# EAGLE design MK (EAGLE 9.4.2)
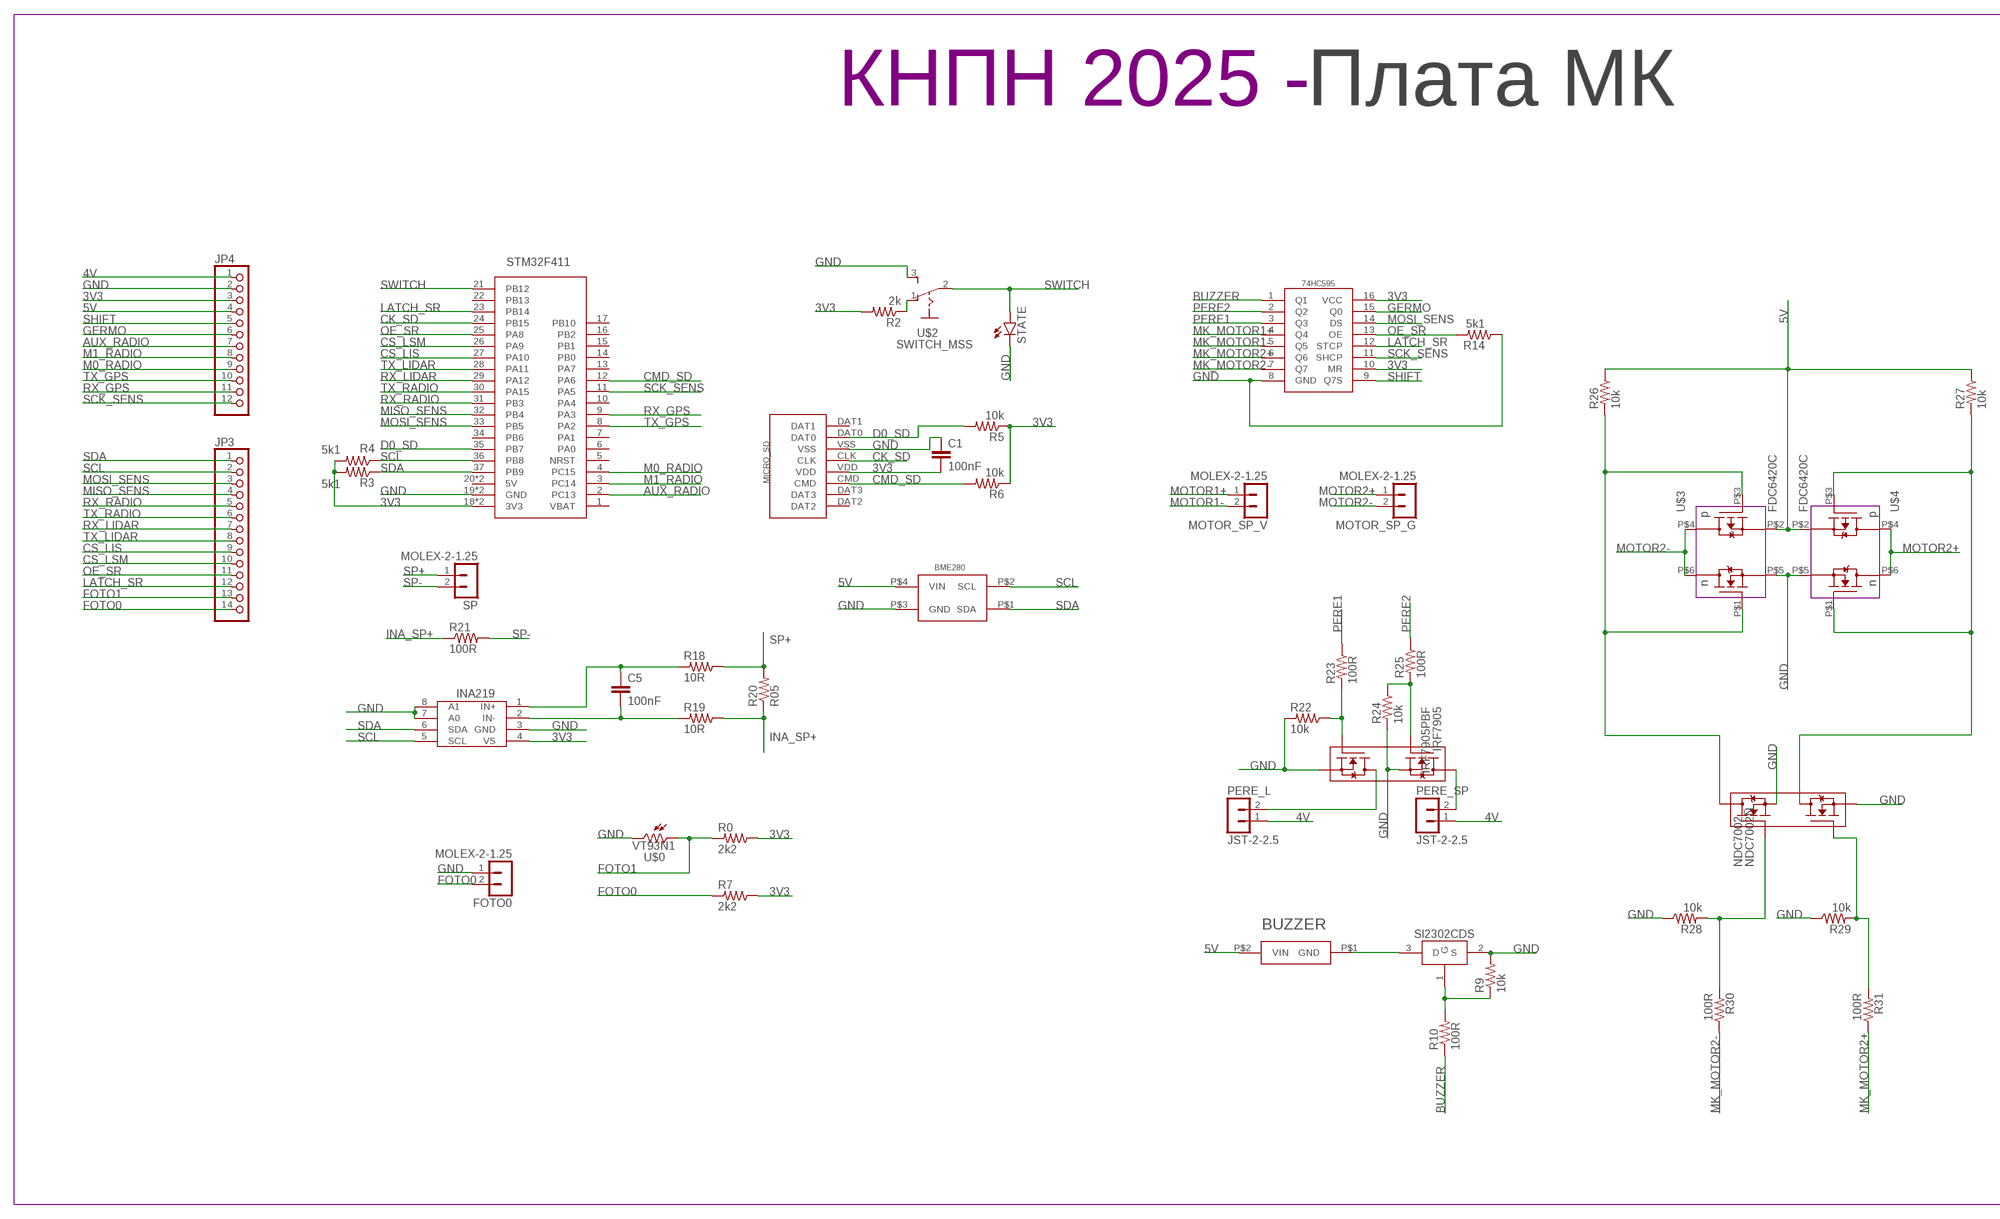
[diagram p0: schematic, sheet 1, part 1 of 2]
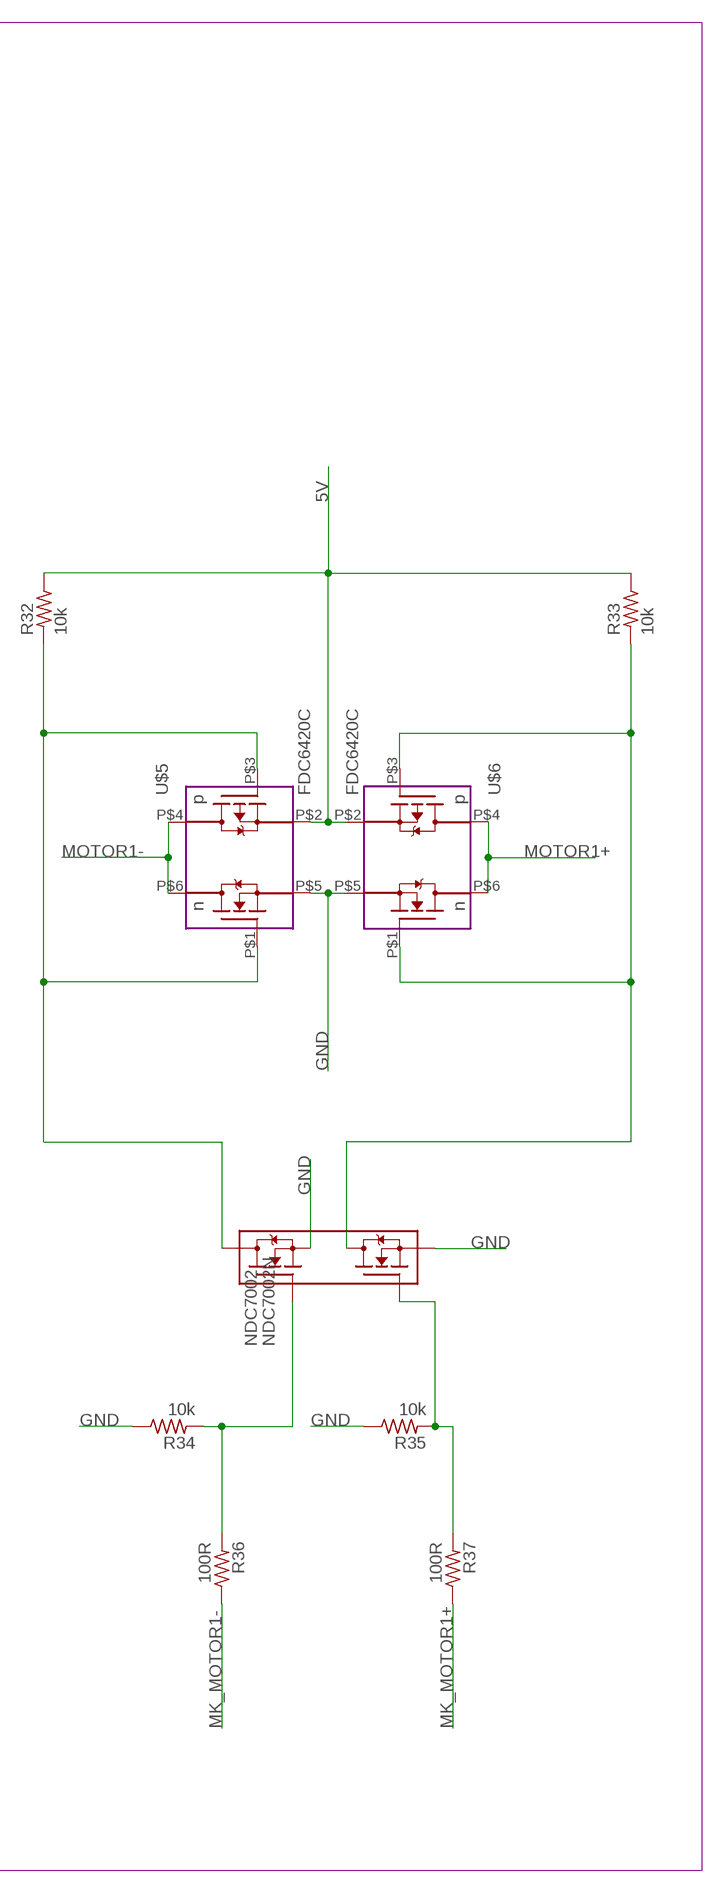
[diagram p1: schematic, sheet 1, part 2 of 2]

## Parts
74HC595  74HC595  [TSSOP16]
BME280  BME280BME280-PINS-ONLY  [BME280-PINS-ONLY]
BUZZER  BUZZERS8R6  [BUZZER-S8R12]
C1  100nF  C-EUC0603  [C0603]
C5  100nF  C-EUC0603  [C0603]
FOTO0  MOLEX-2-1.25  [53047-02]
INA  INA219AID  [SOT23-8]
IRF7905  IRF7905PBF  [SO8]
JP3  PINHD-1X14  [1X14]
JP4  PINHD-1X12  [1X12]
MICRO_SD  SD  [SD]
MOTOR_SP_G  MOLEX-2-1.25  [53047-02]
MOTOR_SP_V  MOLEX-2-1.25  [53047-02]
NDC7002  NDC7002N  [SOT23-6]
NDC7002_  NDC7002N  [SOT23-6]
PERE_L  JST-2-2.5  [JST-2-2.5]
PERE_SP  JST-2-2.5  [JST-2-2.5]
R0  2k2  R-US_R0603  [R0603]
R2  2k  R-US_R0603  [R0603]
R3  5k1  R-US_R0603  [R0603]
R4  5k1  R-US_R0603  [R0603]
R5  10k  R-US_R0603  [R0603]
R6  10k  R-US_R0603  [R0603]
R7  2k2  R-US_R0603  [R0603]
R9  10k  R-US_R0603  [R0603]
R10  100R  R-US_R0603  [R0603]
R14  5k1  R-US_R0603  [R0603]
R18  10R  R-US_R0603  [R0603]
R19  10R  R-US_R0603  [R0603]
R20  R05  R-US_R2512  [R2512]
R21  100R  R-US_0207/15  [0207/15]
R22  10k  R-US_R0603  [R0603]
R23  100R  R-US_R0603  [R0603]
R24  10k  R-US_R0603  [R0603]
R25  100R  R-US_R0603  [R0603]
R26  10k  R-US_R0603  [R0603]
R27  10k  R-US_R0603  [R0603]
R28  10k  R-US_R0603  [R0603]
R29  10k  R-US_R0603  [R0603]
R30  100R  R-US_R0603  [R0603]
R31  100R  R-US_R0603  [R0603]
R32  10k  R-US_R0603  [R0603]
R33  10k  R-US_R0603  [R0603]
R34  10k  R-US_R0603  [R0603]
R35  10k  R-US_R0603  [R0603]
R36  100R  R-US_R0603  [R0603]
R37  100R  R-US_R0603  [R0603]
SI2302  SI2302CDS  [SOT23-3]
SP  MOLEX-2-1.25  [53047-02]
STATE  LEDCHIPLED_0603  [CHIPLED_0603]
STM32F411  STM32F411_BOARD  [STM32F411_BOARD]
U$0  VT93N1  [VT93N1]
U$1  Плата МК  LOGOPCB-""  [LOGO]
U$2  SWITCH_MSS  [SWITCH_MSS]
U$3  FDC6420C  [TSOP-6]
U$4  FDC6420C  [TSOP-6]
U$5  FDC6420C  [TSOP-6]
U$6  FDC6420C  [TSOP-6]

## Nets
3V3: 74HC595.10(MR) 74HC595.16(VCC) C1.2 INA.4(VS) JP4.3 MICRO_SD.VDD R0.1 R2.2 R3.2 R4.2 R5.1 R6.1 R7.1 STM32F411.18(3V3) STM32F411.40(3V3)
4V: JP4.1 PERE_L.1 PERE_SP.1
5V: BME280.P$4(VIN) BUZZER.P$2(VIN) JP4.4 R26.1 R27.1 R32.1 R33.1 U$3.P$2(PS) U$4.P$2(PS) U$5.P$2(PS) U$6.P$2(PS)
AUX_RADIO: JP4.7 STM32F411.2(PC13)
BUZZER: 74HC595.1(Q1) R10.1
CK_SD: MICRO_SD.CLK STM32F411.24(PB15)
CMD_SD: MICRO_SD.CMD R6.2 STM32F411.12(PA6)
CS_LIS: JP3.9 STM32F411.27(PA10)
CS_LSM: JP3.10 STM32F411.26(PA9)
D0_SD: MICRO_SD.DAT0 R5.2 STM32F411.35(PB7)
FOTO0: FOTO0.2 JP3.14 R7.2
FOTO1: JP3.13 R0.2 U$0.P$1
GERMO: 74HC595.15(Q0) JP4.6
GND: 74HC595.8(GND) BME280.P$3(GND) C1.1 FOTO0.1 INA.3(GND) INA.7(A0) INA.8(A1) IRF7905.1(S2) IRF7905.3(S1) JP4.2 MICRO_SD.VSS NDC7002.2(S2) NDC7002.5(S1) NDC7002_.2(S2) NDC7002_.5(S1) R9.2 R14.1 R22.2 R24.2 R28.1 R29.1 R34.1 R35.1 SI2302.2(S) STATE.C STM32F411.19(GND) STM32F411.39(GND) U$0.P$2 U$2.3(S) U$3.P$5(NS) U$4.P$5(NS) U$5.P$5(NS) U$6.P$5(NS)
INA_SP+: R19.1 R20.1 R21.1
LATCH_SR: 74HC595.12(STCP) JP3.12 STM32F411.23(PB14)
M0_RADIO: JP4.9 STM32F411.4(PC15)
M1_RADIO: JP4.8 STM32F411.3(PC14)
MISO_SENS: JP3.4 STM32F411.32(PB4)
MK_MOTOR1+: 74HC595.4(Q4) R37.1
MK_MOTOR1-: 74HC595.5(Q5) R36.1
MK_MOTOR2+: 74HC595.6(Q6) R31.1
MK_MOTOR2-: 74HC595.7(Q7) R30.1
MOSI_SENS: 74HC595.14(DS) JP3.3 STM32F411.33(PB5)
MOTOR1+: MOTOR_SP_V.1 U$6.P$4(PD) U$6.P$6(ND)
MOTOR1-: MOTOR_SP_V.2 U$5.P$4(PD) U$5.P$6(ND)
MOTOR2+: MOTOR_SP_G.1 U$4.P$4(PD) U$4.P$6(ND)
MOTOR2-: MOTOR_SP_G.2 U$3.P$4(PD) U$3.P$6(ND)
N$2: R2.1 U$2.1(O)
N$13: BUZZER.P$1(GND) SI2302.3(D)
N$14: R9.1 R10.2 SI2302.1(G)
N$15: C5.2 INA.2(IN-) R19.2
N$18: C5.1 INA.1(IN+) R18.2
N$20: IRF7905.7(D2) IRF7905.8(D2) PERE_L.2
N$21: IRF7905.5(D1) IRF7905.6(D1) PERE_SP.2
N$22: IRF7905.2(G2) R22.1 R23.2
N$23: IRF7905.4(G1) R24.1 R25.2
N$24: NDC7002.6(D1) R32.2 U$5.P$1(NG) U$5.P$3(PG)
N$25: NDC7002_.6(D1) R26.2 U$3.P$1(NG) U$3.P$3(PG)
N$26: NDC7002_.4(D2) R27.2 U$4.P$1(NG) U$4.P$3(PG)
N$27: NDC7002.4(D2) R33.2 U$6.P$1(NG) U$6.P$3(PG)
N$28: NDC7002.1(G1) R34.2 R36.2
N$29: NDC7002.3(G2) R35.2 R37.2
N$32: NDC7002_.1(G1) R28.2 R30.2
N$35: NDC7002_.3(G2) R29.2 R31.2
OE_SR: 74HC595.13(OE) JP3.11 R14.2 STM32F411.25(PA8)
PERE1: 74HC595.3(Q3) R23.1
PERE2: 74HC595.2(Q2) R25.1
RX_GPS: JP4.11 STM32F411.9(PA3)
RX_LIDAR: JP3.7 STM32F411.29(PA12)
RX_RADIO: JP3.5 STM32F411.31(PB3)
SCK_SENS: 74HC595.11(SHCP) JP4.12 STM32F411.11(PA5)
SCL: BME280.P$2(SCL) INA.5(SCL) JP3.2 R4.1 STM32F411.36(PB8)
SDA: BME280.P$1(SDA) INA.6(SDA) JP3.1 R3.1 STM32F411.37(PB9)
SHIFT: 74HC595.9(Q7S) JP4.5
SP+: R18.1 R20.2 SP.1
SP-: R21.2 SP.2
SWITCH: STATE.A STM32F411.21(PB12) U$2.2(P)
TX_GPS: JP4.10 STM32F411.8(PA2)
TX_LIDAR: JP3.8 STM32F411.28(PA11)
TX_RADIO: JP3.6 STM32F411.30(PA15)
Unconnected: MICRO_SD.DAT1 MICRO_SD.DAT2 MICRO_SD.DAT3 STM32F411.1(VBAT) STM32F411.5(NRST) STM32F411.6(PA0) STM32F411.7(PA1) STM32F411.10(PA4) STM32F411.13(PA7) STM32F411.14(PB0) STM32F411.15(PB1) STM32F411.16(PB2) STM32F411.17(PB10) STM32F411.20(5V) STM32F411.22(PB13) STM32F411.34(PB6) STM32F411.38(5V)

## Library data of the parts
74HC595 = CanCubeSat:74HC595
BME280 = UNKNOWN-2024:BME280
BUZZER = CanCubeSat:BUZZER
C1 C5 = rcl:C-EU: CAPACITOR, European symbol; SPICEPREFIX: C
FOTO0 MOTOR_SP_G MOTOR_SP_V SP = UNKNOWN-2024:MOLEX-2-1.25
INA = CanCubeSat:INA219AID
IRF7905 = UNKNOWN-2024:IRF7905PBF
JP3 = pinhead:PINHD-1X14: PIN HEADER
JP4 = pinhead:PINHD-1X12: PIN HEADER
MICRO_SD = UNKNOWN-2024:SD
NDC7002 NDC7002_ = UNKNOWN-2024:NDC7002N
PERE_L PERE_SP = UNKNOWN-2024:JST-2-2.5: JST PH series header 2.00mm pitch disconnectable crimp style connectors, vertical (side entry type), 2 pins
R0 R2-R7 R9 R10 R14 R18-R37 = rcl:R-US_: RESISTOR, American symbol; SPICEPREFIX: R
SI2302 = CanCubeSat:SI2302CDS
STATE = led:LED: LED OSRAM: - CHIPLED LG R971, LG N971, LY N971, LG Q971, LY Q971, LO R971, LY R971 LH N974, LH R974 LS Q976, LO Q976, LY Q976 LO Q996 - Hyper CHIPLED LW Q18S LB Q993, LB Q99A, LB R99A - SideLED LS A670, LO A670, LY A670, LG A670, LP A670 LB A673, LV A673, LT A673, LW A673 LH A674 LY A675 LS A676, LA A676, LO A676, LY A676, LW A676 LS A679, LY A679, LG A679 - Hyper Micro SIDELED® LS Y876, LA Y876, LO Y876, LY Y876 LT Y87S - SmartLED LW L88C, LW L88S LB L89C, LB L89S, LG L890 LS L89K, LO L89K, LY L89K LS L896, LA L896, LO L896, LY L896 - TOPLED LS T670, LO T670, LY T670, LG T670, LP T670 LSG T670, LSP T670, LSY T670, LOP T670, LYG T670 LG T671, LOG T671, LSG T671 LB T673, LV T673, LT T673, LW T673 LH T674 LS T676, LA T676, LO T676, LY T676, LB T676, LH T676, LSB T676, LW T676 LB T67C, LV T67C, LT T67C, LS T67K, LO T67K, LY T67K, LW E67C LS E67B, LA E67B, LO E67B, LY E67B, LB E67C, LV E67C, LT E67C LW T67C LS T679, LY T679, LG T679 LS T770, LO T770, LY T770, LG T770, LP T770 LB T773, LV T773, LT T773, LW T773 LH T774 LS E675, LA E675, LY E675, LS T675 LS T776, LA T776, LO T776, LY T776, LB T776 LHGB T686 LT T68C, LB T68C - Hyper Mini TOPLED® LB M676 - Mini TOPLED Santana® LG M470 LS M47K, LO M47K, LY M47K Source: http://www.osram.convergy.de LUXEON: - LUMILED® LXK2-PW12-R00, LXK2-PW12-S00, LXK2-PW14-U00, LXK2-PW14-V00 LXK2-PM12-R00, LXK2-PM12-S00, LXK2-PM14-U00 LXK2-PE12-Q00, LXK2-PE12-R00, LXK2-PE12-S00, LXK2-PE14-T00, LXK2-PE14-U00 LXK2-PB12-K00, LXK2-PB12-L00, LXK2-PB12-M00, LXK2-PB14-N00, LXK2-PB14-P00, LXK2-PB14-Q00 LXK2-PR12-L00, LXK2-PR12-M00, LXK2-PR14-Q00, LXK2-PR14-R00 LXK2-PD12-Q00, LXK2-PD12-R00, LXK2-PD12-S00 LXK2-PH12-R00, LXK2-PH12-S00 LXK2-PL12-P00, LXK2-PL12-Q00, LXK2-PL12-R00 Source: www.luxeon.com KINGBRIGHT: KA-3528ASYC Source: www.kingbright.com
STM32F411 = UNKNOWN-2024:STM32F411_BOARD
U$0 = KNPN-2023:VT93N1
U$1 = UNKNOWN-2024:LOGO
U$2 = UNKNOWN-2024:SWITCH_MSS
U$3-U$6 = KNPN-2023:FDC6420C

## Board
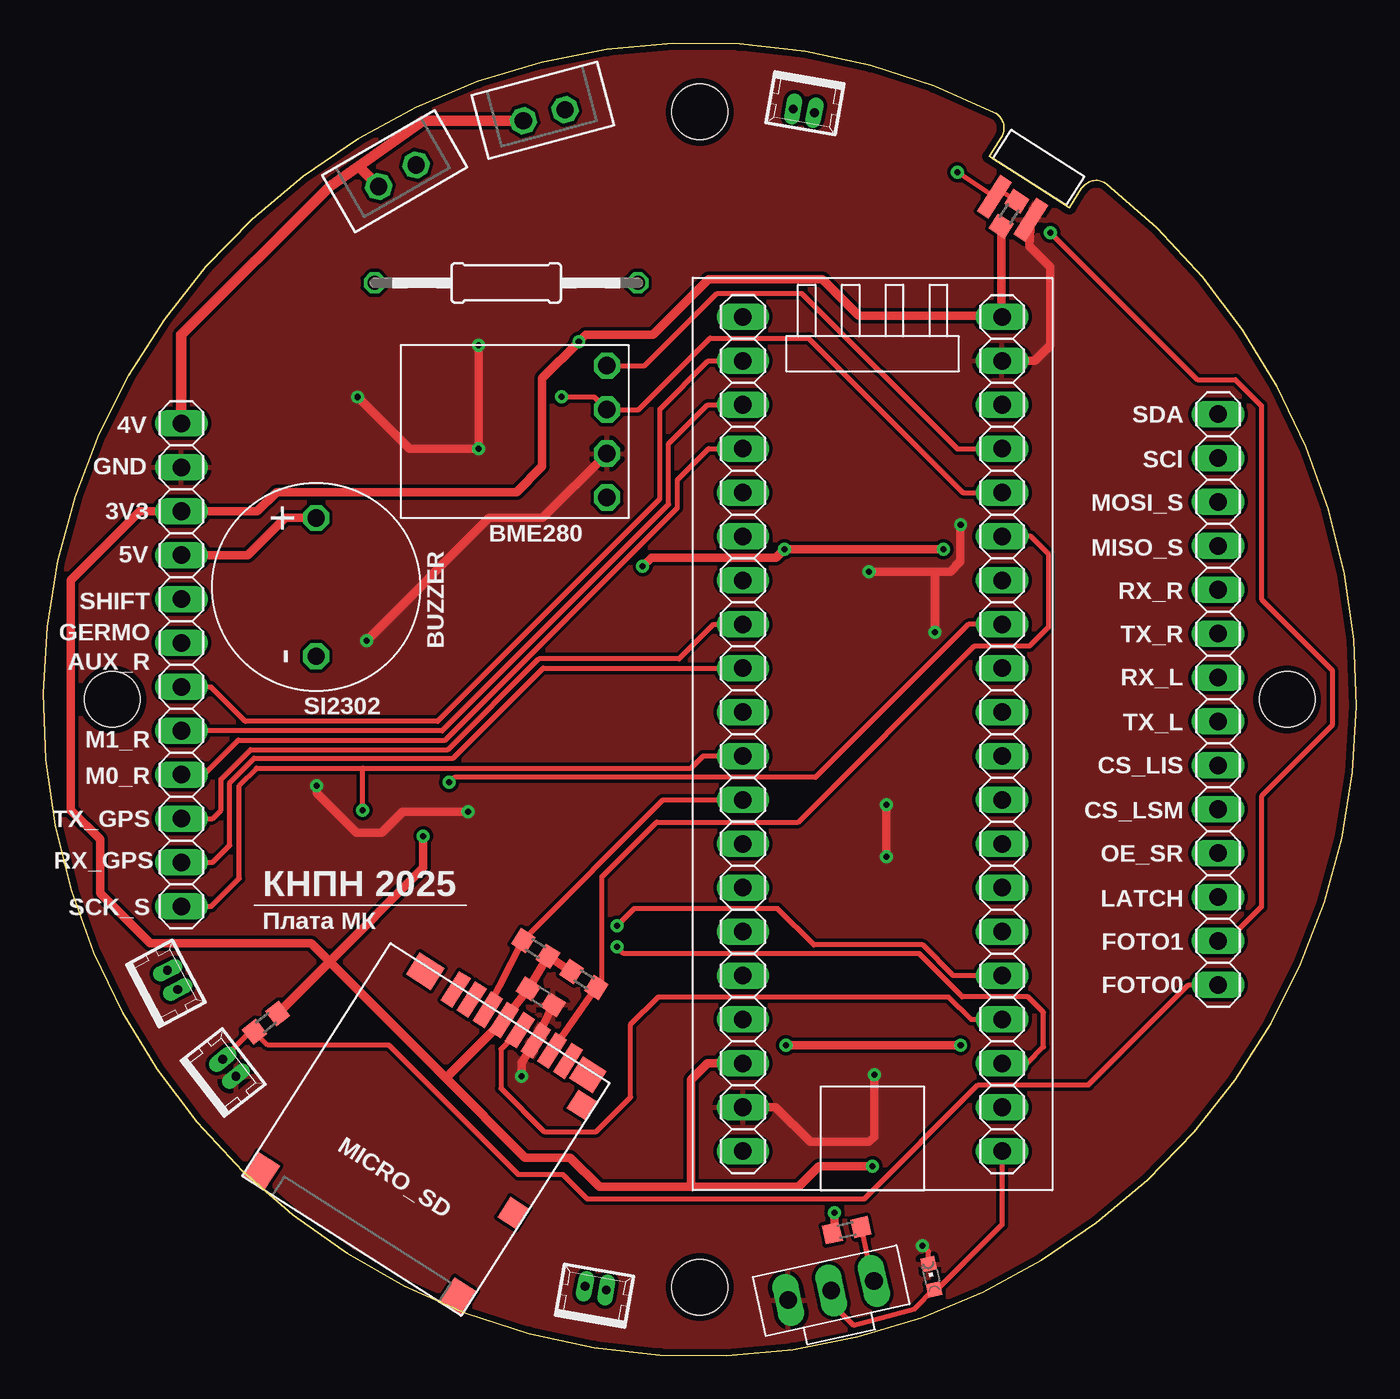
[diagram p2: board, top side]
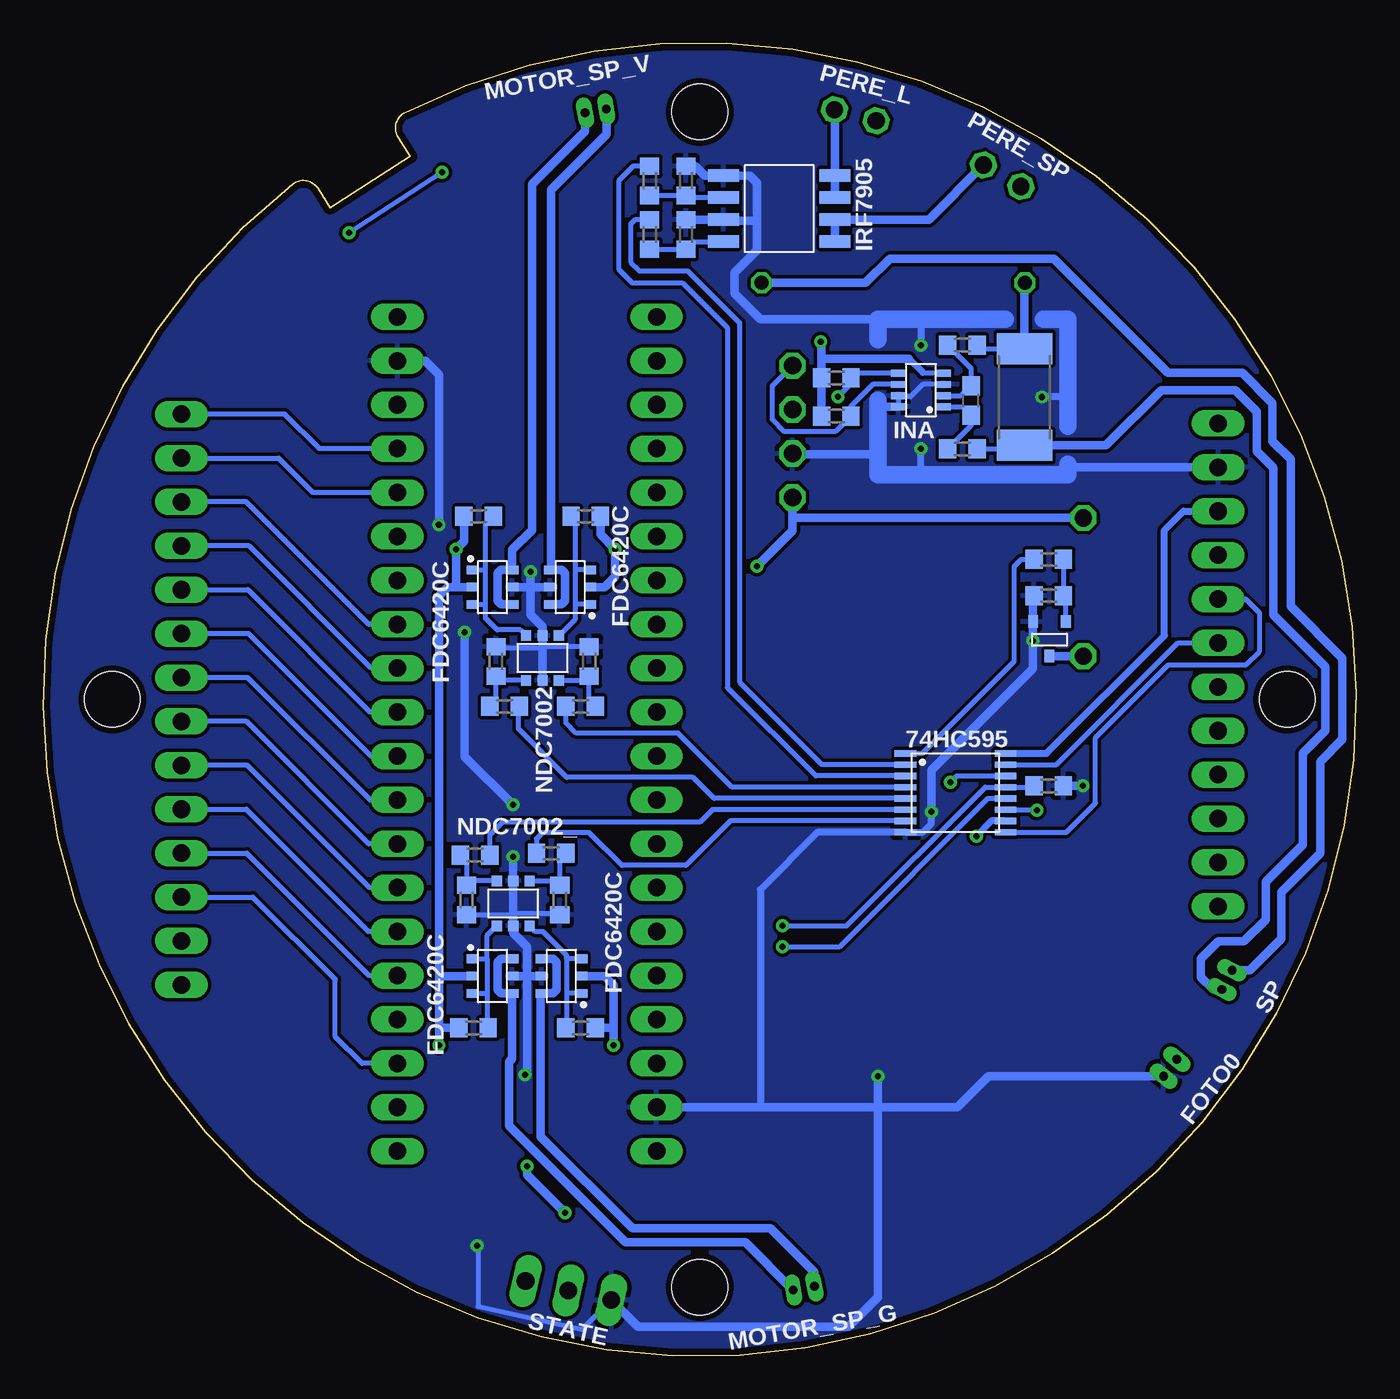
[diagram p3: board, bottom side, seen from below]

Size 76 x 75.94 mm. Coordinates in mm from the lower left corner, seen from the top.
Outline: 55.46,70.49 54.75,69.39 59.39,66.43 60.09,67.54 arc-96 61.56,67.78 arc-348 55.06,71.92 arc-96 55.46,70.49
Copper layers (1*16): Top 0.035mm / dielectric 1.5mm / Bottom 0.035mm
Design rules "default *": minimum track width 0.3mm, minimum drill 0.35mm, track to track 0.2mm, track to pad 0.2mm, pad to pad 0.2mm, via to via 0.2mm, smd to smd 0.2mm, copper to edge 0.35mm, drill to drill 0.2mm, minimum pad ring 0.2mm, minimum via ring 0.2mm, stop-mask expansion 4mil, vias tented up to drill 0mil, thermal gap 10mil
Holes 3.2 mm at 4,37.97 38,3.97 72,37.97 38,71.97

### Footprints (pad centres in the part's own frame; a part is rotated, then mirrored left to right if it is on the bottom)
TSSOP16 = smd 1.26 x 0.36: 1 -2.9,2.275; 2 -2.9,1.625; 3 -2.9,0.975; 4 -2.9,0.325; 5 -2.9,-0.325; 6 -2.9,-0.975; 7 -2.9,-1.625; 8 -2.9,-2.275; 9 2.9,-2.275; 10 2.9,-1.625; 11 2.9,-0.975; 12 2.9,-0.325; 13 2.9,0.325; 14 2.9,0.975; 15 2.9,1.625; 16 2.9,2.275
BME280-PINS-ONLY = drill 1.016 octagon: P$1 -3.81,5.33; P$2 -1.27,5.33; P$3 1.27,5.33; P$4 3.81,5.33
BUZZER-S8R12 = drill 1 octagon: P$1 -4,0; P$2 4,0
C0603 = smd 1.1 x 1: 1 -0.85,0; 2 0.85,0
53047-02 = drill 0.5 pad 0.698 long: 1 0.625,0.45; 2 -0.625,0.45
SOT23-8 = smd 0.9 x 0.4: 1 -1.3,0.975; 2 -1.3,0.325; 3 -1.3,-0.325; 4 -1.3,-0.975; 5 1.3,-0.975; 6 1.3,-0.325; 7 1.3,0.325; 8 1.3,0.975
SO8 = smd 0.72 x 1.78: 1 -1.905,-3.23; 2 -0.635,-3.23; 3 0.635,-3.23; 4 1.905,-3.23; 5 1.905,3.23; 6 0.635,3.23; 7 -0.635,3.23; 8 -1.905,3.23
1X14 = drill 1.016 long: 1 -16.51,0; 2 -13.97,0; 3 -11.43,0; 4 -8.89,0; 5 -6.35,0; 6 -3.81,0; 7 -1.27,0; 8 1.27,0; 9 3.81,0; 10 6.35,0; 11 8.89,0; 12 11.43,0; 13 13.97,0; 14 16.51,0
1X12 = drill 1.016 long: 1 -13.97,0; 2 -11.43,0; 3 -8.89,0; 4 -6.35,0; 5 -3.81,0; 6 -1.27,0; 7 1.27,0; 8 3.81,0; 9 6.35,0; 10 8.89,0; 11 11.43,0; 12 13.97,0
SD = smd 0.8 x 2: CLK 6,-15.77; CMD 8.2,-15.77; DAT0 3.8,-15.77; DAT1 2.7,-15.77; DAT2 10.4,-15.77; DAT3 9.3,-15.77; VDD 7.1,-15.77; VSS 4.9,-15.77 | smd 1.5 x 1.7: P$9 0.75,-0.85; P$13 14.25,-0.85 | smd 1.6 x 1.5: P$10 1.3,-15.7 | smd 1.29 x 1.3: P$11 0.645,-14.05 | smd 1.29 x 1.4: P$12 0.645,-6.65 | smd 1.7 x 1.5: P$14 12.45,-15.7
SOT23-6 = smd 0.6 x 0.6: 1 -0.95,-1.3; 2 0,-1.3; 3 0.95,-1.3; 4 0.95,1.3; 5 0,1.3; 6 -0.95,1.3
JST-2-2.5 = drill 1 pad 1.5 octagon: 1 1.25,0; 2 -1.25,0
R0603 = smd 1 x 1.1: 1 -0.85,0; 2 0.85,0
R2512 = smd 1.8 x 3.2: 1 -2.8,0; 2 2.8,0
0207/15 = drill 0.813 octagon: 1 -7.62,0; 2 7.62,0
SOT23-3 = smd 0.56 x 0.73: 1 -0.95,-1; 2 0.95,-1; 3 0,1
CHIPLED_0603 = smd 0.8 x 0.8: A 0,-0.75; C 0,0.75
STM32F411_BOARD = drill 1.016 long: 1 24.13,7.5; 2 21.59,7.5; 3 19.05,7.5; 4 16.51,7.5; 5 13.97,7.5; 6 11.43,7.5; 7 8.89,7.5; 8 6.35,7.5; 9 3.81,7.5; 10 1.27,7.5; 11 -1.27,7.5; 12 -3.81,7.5; 13 -6.35,7.5; 14 -8.89,7.5; 15 -11.43,7.5; 16 -13.97,7.5; 17 -16.51,7.5; 18 -19.05,7.5; 19 -21.59,7.5; 20 -24.13,7.5; 21 -24.13,-7.5; 22 -21.59,-7.5; 23 -19.05,-7.5; 24 -16.51,-7.5; 25 -13.97,-7.5; 26 -11.43,-7.5; 27 -8.89,-7.5; 28 -6.35,-7.5; 29 -3.81,-7.5; 30 -1.27,-7.5; 31 1.27,-7.5; 32 3.81,-7.5; 33 6.35,-7.5; 34 8.89,-7.5; 35 11.43,-7.5; 36 13.97,-7.5; 37 16.51,-7.5; 38 19.05,-7.5; 39 21.59,-7.5; 40 24.13,-7.5
VT93N1 = smd 0.8 x 2.5: P$1 -1.25,-1.8; P$2 1.25,-1.8
SWITCH_MSS = drill 1.016 long: 1 -2.54,0; 2 0,0; 3 2.54,0
TSOP-6 = smd 0.5 x 0.7: P$1 -1,-1.15; P$2 0,-1.15; P$3 1,-1.15; P$4 1,1.15; P$5 0,1.15; P$6 -1,1.15

### Placement (x,y rotation side)
74HC595  23.2,32.57 0 bottom
BME280  27.3,53.47 270 top
BUZZER  15.8,44.47 90 top
C1  28.8,20.77 147.5 top
C5  22.3,55.27 90 bottom
FOTO0  10.42,16.39 308 top
INA  25.2,55.87 180 bottom
IRF7905  33.4,66.37 270 bottom
JP3  68,37.97 270 top
JP4  8,39.97 270 top
MICRO_SD  24.17,2.31 147.5 top
MOTOR_SP_G  31.9,3.47 350 top
MOTOR_SP_V  44.1,72.47 170 top
NDC7002  47.1,40.37 0 bottom
NDC7002_  48.8,26.17 180 bottom
PERE_L  29,71.77 195 top
PERE_SP  20.5,68.27 210 top
R0  55.9,66.07 57.5 top
R2  46.5,7.27 192.5 top
R3  30.1,54.37 180 bottom
R4  30.1,56.57 180 bottom
R5  31.3,21.77 327.5 top
R6  28.5,23.57 147.5 top
R7  12.9,19.27 218 top
R9  17.8,43.97 180 bottom
R10  17.8,46.07 0 bottom
R14  17.8,32.97 180 bottom
R18  22.8,52.47 180 bottom
R19  22.8,58.47 180 bottom
R20  19.2,55.47 270 bottom
R21  26.8,62.07 0 top
R22  38.8,67.97 90 bottom
R23  40.9,67.97 270 bottom
R24  38.8,64.87 90 bottom
R25  40.9,64.87 270 bottom
R26  44.9,18.97 180 bottom
R27  51.1,18.97 0 bottom
R28  46.1,26.37 90 bottom
R29  51.5,26.37 90 bottom
R30  46.6,29.07 0 bottom
R31  51,28.97 180 bottom
R32  50.8,48.57 0 bottom
R33  44.6,48.57 180 bottom
R34  49.8,40.17 270 bottom
R35  44.4,40.17 270 bottom
R36  49.3,37.57 180 bottom
R37  44.9,37.57 0 bottom
SI2302  17.76,41.47 180 bottom
SP  7.09,21.54 298 top
STATE  51.4,4.57 12.5 top
STM32F411  48,35.97 90 top
U$0  57.07,67.91 327.5 top
U$1  12.2,26.07 0 top
U$2  45.6,3.77 192.5 top
U$3  46,21.97 90 bottom
U$4  50,21.97 270 bottom
U$5  50,44.47 270 bottom
U$6  45.5,44.47 90 bottom

### Tracks (layer width: path | path; a pad name or v marks a point on that pad's centre or on a via)
3V3  (via drill 0.35)
  Top 0.5: R0.1 55.44,60.16 | 55.44,60.16 STM32F411.40 | 55.44,60.16 47.21,60.16 45.1,62.27 38.5,62.27 35.3,59.07 31.4,59.07 v31,58.67 28.88,56.55 28.88,51.45 27.4,49.97 13.5,49.97 12.39,48.86 JP4.3 5.59,48.86 1.6,44.87 1.6,31.57 3.3,29.87 3.3,26.77 6.2,23.87 15.5,23.87 16.45,22.92 | v48,10.97 44.9,10.97 43.7,9.77 37.5,9.77 | v45.8,8.27 45.8,7.21 R2.2 | R5.1 R6.1 C1.2 MICRO_SD.VDD 25.84,18.61 25.81,18.56 25.79,18.56 23.4,16.17 23.2,16.17 | 37.5,9.77 32.2,9.77 30.5,11.47 27.9,11.47 23.2,16.17 | STM32F411.18 38.45,16.92 37.5,15.97 37.5,9.77 | 23.2,16.17 16.45,22.92 | R7.1 16.45,22.67 | 16.45,22.67 16.45,22.92 | v22,30.07 22,28.22 16.45,22.67
  Bottom 0.3: INA.4 25.03,56.84 25.08,56.89
  Bottom 0.4: 25.08,56.89 25.88,57.69 | 74HC595.16 17.92,34.84 11.1,41.67 11.1,47.77 10.01,48.86 JP4.3 | 74HC595.10 21.12,30.94 v22,30.07
  Bottom 0.5: R3.2 R4.2 30.95,57.67 | 30.95,57.67 30.95,58.62 v31,58.67 | 30.95,57.67 30.92,57.69 25.88,57.69 | v48,10.97 48,10.47 v45.8,8.27
4V
  Top 0.6: JP4.1 8,59.07 16.6,67.67 18.26,68.83 | 18.26,68.83 21.99,71.44 PERE_L.1 | PERE_SP.1 19.41,67.67 18.26,68.83
5V  (via drill 0.35)
  Top 0.5: v53.1,17.97 v43,17.97 | v52.1,46.67 v42.9,46.67 42.4,46.17 35.2,46.17 v34.7,45.67 | JP4.4 11.85,46.32 14,48.47 BUZZER.P$2
  Bottom 0.5: 53.1,18.97 53.1,21.97 | 53.1,21.97 53.1,43.97 52.6,44.47 52,44.47 | v53.1,17.97 53.1,18.97 | v34.7,45.67 32.63,47.74 32.63,48.47 | 32.63,48.47 BME280.P$4 | BUZZER.P$2 32.63,48.47 | U$4.P$2 53.1,21.97 | U$3.P$2 43.5,21.97 43,21.47 43,18.97 | 43,18.97 v43,17.97 | 43,18.97 R26.1 | R27.1 53.1,18.97 | R32.1 51.65,47.12 v52.1,46.67 52.1,44.57 52,44.47 | U$5.P$2 52,44.47 | U$6.P$2 43.5,44.47 42.9,45.07 v42.9,46.67 43.75,47.52 R33.1
AUX_RADIO
  Top 0.3: JP4.7 9.7,38.7 11.7,36.7 22.83,36.7 35.7,49.57 35.7,54.77 38.49,57.56 STM32F411.2
BUZZER
  Bottom 0.3: 74HC595.1 25.12,34.84 19.8,40.17 19.8,45.67 19.4,46.07 R10.1
CK_SD
  Top 0.3: STM32F411.24 53.71,19.46 52.4,20.77 35.6,20.77 34,19.17 34,14.97 32,12.97 29,12.97 26.5,15.47 26.5,17.75 MICRO_SD.CLK
CMD_SD
  Top 0.3: R6.2 35.87,32.16 STM32F411.12
  Top 0.4: MICRO_SD.CMD R6.2
CS_LIS
  Bottom 0.3: STM32F411.27 57.11,27.08 64.19,34.17 64.2,34.16 JP3.9
CS_LSM
  Bottom 0.3: STM32F411.26 57.17,24.54 64.25,31.62 JP3.10
D0_SD
  Top 0.3: STM32F411.35 57.17,47.4 58.2,46.37 58.2,42.17 57.1,41.07 53.9,41.07 43.7,30.87 35.5,30.87 32.31,27.69 32.31,21.61 R5.2
  Top 0.4: MICRO_SD.DAT0 R5.2
FOTO0
  Top 0.3: JP3.14 66.29,21.46 60.5,15.67 54.1,15.67 47.5,9.07 31.5,9.07 30.08,10.48 27.5,10.48 20.01,17.97 13,17.97 R7.2 11.98,18.75 FOTO0.2
FOTO1  (via drill 0.35)
  Top 0.3: JP3.13 68.53,24 70.5,25.97 70.5,32.37 74.6,36.47 74.6,39.67 70.5,43.77 70.5,54.97 69,56.47 66.8,56.47 v58.3,64.97 | v52.9,68.47 U$0.P$1 55.39,67.4 R0.2
  Bottom 0.3: v52.9,68.47 v58.3,64.97
GERMO
  Bottom 0.3: 74HC595.15 17.37,34.19 10.33,41.24 JP4.6
GND  (via drill 0.35)
  Top 0.3: STATE.C 51.24,6.03 v50.9,6.37
  Top 0.5: v18.2,55.47 21.2,52.47 v25.2,52.47 v25.2,58.47 | v48.1,16.27 48.1,12.67 47.8,12.37 44.4,12.37 42.39,14.38 STM32F411.19 | U$0.P$2 57.08,64.18 58.3,62.97 58.3,58.47 57.39,57.56 STM32F411.39 | v24.6,31.47 20.8,31.47 19.6,30.27 18.13,30.27 15.83,32.57 v15.83,32.97 | v18.71,41.37 25.81,48.47 28.9,48.47 BME280.P$3 | v48.8,31.87 v48.8,28.87 | v53.1,48.07 53.1,45.97 52.5,45.37 51.6,45.37 | v47.8,45.37 51.6,45.37 | v51.6,41.87 51.6,45.37 | C1.1 MICRO_SD.VSS 27.7,16.96 v27.7,16.17
  Bottom 0.3: INA.3 25.07,56.19 25.8,55.47 26.42,55.47 INA.7 INA.8 | R28.1 46.15,25.57 48.8,25.57 48.85,25.52 R29.1 | R35.1 47.05,41.02 47.1,40.97 49.75,40.97 R34.1 | v50.9,6.37 50.83,6.3 50.83,2.85 44.82,1.52 U$2.3
  Bottom 0.4: 25.2,59.97 v25.2,58.47 | 25.2,50.97 v25.2,52.47 | 16.7,55.47 v18.2,55.47 | v24.6,31.47 24.6,30.77 25.07,30.29 74HC595.8 31.17,30.29 34.5,26.97 34.5,14.38
  Bottom 0.5: NDC7002.2 47.1,40.97 NDC7002.5 47.1,42.17 47.8,42.87 47.8,44.47 | R22.2 38.25,68.82 37.7,68.27 IRF7905.1 | IRF7905.1 | R24.2 38.78,65.73 IRF7905.3 36.56,65.67 34.7,65.67 | INA.8 27.57,54.89 27.7,54.77 | R9.2 18.71,43.91 SI2302.2 v18.71,41.37 18.71,39.76 24.6,33.87 v24.6,31.47 | IRF7905.1 35.1,68.27 34.7,67.87 34.7,65.67 | BME280.P$3 32.6,52.17 27.7,52.17 | JP4.2 16.53,51.4 16.7,51.57 | STM32F411.19 34.5,14.38 27.69,14.38 | R14.1 v15.83,32.97 | 27.7,59.97 34.5,59.97 36,61.47 36,62.67 34.7,63.97 34.7,65.67 | v51.6,41.87 51.6,34.67 v48.8,31.87 | v48.8,28.87 NDC7002_.2 48.8,25.57 NDC7002_.5 48.8,24.47 48,23.67 48,21.97 | STM32F411.39 53.89,57.56 53.1,56.77 v53.1,48.07 | U$2.3 41.57,1.67 29.4,1.67 27.69,3.38 27.69,14.38 | U$4.P$5 48,21.97 | U$3.P$5 48,21.97 | v48.1,16.27 48,16.37 48,21.97 | 47.8,44.47 v47.8,45.37 | U$6.P$5 47.8,44.47 | U$5.P$5 47.8,44.47 | 27.69,14.38 v27.69,16.16 v27.7,16.17 | FOTO0.1 21.29,16.17 23.09,14.38 27.69,14.38
  Bottom 1: 27.7,55.27 27.7,54.77 27.7,52.17 27.7,50.97 25.2,50.97 16.7,50.97 16.7,51.57 | 18.1,59.97 16.7,59.97 16.7,55.47 16.7,53.77 | 27.7,58.77 27.7,59.97 25.2,59.97 20.3,59.97
  pour Bottom: 22.2,75.97 53.7,75.97 76,53.67 76,22.27 53.7,-0.03 22.2,-0.03 0,22.17 0,53.77
  pour Top: 0,53.77 22.2,75.97 53.7,75.97 76,53.67 76,22.27 53.7,-0.03 22.2,-0.03 0,22.17
INA_SP+
  Bottom 0.3: R19.1 21.75,58.27 R20.1
  Bottom 0.5: R21.1 19.2,62.05 R20.1
LATCH_SR  (via drill 0.35)
  Top 0.3: STM32F411.23 56.95,16.92 57.9,17.87 57.9,19.87 57,20.77 53.2,20.77 50.7,23.27 33.6,23.27 v33.2,23.67
  Bottom 0.3: STM32F411.23 57.55,16.92 59.1,18.47 59.1,21.77 63.87,26.54 JP3.12 | v33.2,23.67 29.9,23.67 21.32,32.24 74HC595.12
M0_RADIO
  Top 0.3: STM32F411.4 38.51,52.48 36.7,50.67 36.7,49.05 23.26,35.62 11.3,35.62 9.3,33.62 JP4.9
M1_RADIO
  Top 0.3: JP4.8 23.09,36.16 36.2,49.26 36.2,52.77 38.45,55.02 STM32F411.3
MISO_SENS
  Bottom 0.3: STM32F411.32 57.01,39.78 64.09,46.86 JP3.4
MK_MOTOR1+
  Bottom 0.3: 74HC595.4 36.12,32.89 39.26,36.03 45.16,36.03 45.75,36.62 R37.1
MK_MOTOR1-
  Bottom 0.3: 74HC595.5 37.17,32.24 38.4,33.47 45.7,33.47 48.5,36.27 48.5,37.52 R36.1
MK_MOTOR2+
  Bottom 0.3: 74HC595.6 37.27,31.59 38,30.87 49.4,30.87 50.15,30.12 R31.1
MK_MOTOR2-
  Bottom 0.3: 74HC595.7 36.22,30.94 38.8,28.37 42.5,28.37 44.4,30.27 47.1,30.27 47.45,29.92 R30.1
MOSI_SENS  (via drill 0.35)
  Top 0.3: STM32F411.33 53.55,42.32 44.7,33.47 23.8,33.47 v23.5,33.17
  Bottom 0.3: STM32F411.33 57.15,42.32 64.22,49.39 64.22,49.4 JP3.3 | v23.5,33.17 23.12,33.54 74HC595.14
MOTOR1+
  Bottom 0.5: MOTOR_SP_V.1 43.4,70.66 46.6,67.47 46.6,45.52 U$6.P$4 46,45.47 45.8,45.27 45.8,43.67 46,43.47 U$6.P$6
MOTOR1-
  Bottom 0.5: MOTOR_SP_V.2 44.63,70.83 47.7,67.77 47.7,47.77 48.85,46.62 U$5.P$6 49.5,45.47 49.7,45.27 49.7,43.67 49.5,43.47 U$5.P$4
MOTOR2+
  Bottom 0.5: MOTOR_SP_G.1 35.36,6.57 42.3,6.57 49.03,13.3 49.03,17.01 48.85,17.19 U$4.P$4 49.5,20.97 49.7,21.17 49.7,22.77 49.5,22.97 U$4.P$6
MOTOR2-
  Bottom 0.5: MOTOR_SP_G.2 31.36,4.83 33.9,7.37 41.9,7.37 47.2,12.67 47.2,20.92 U$3.P$6 46.5,20.97 46.3,21.17 46.3,22.77 46.5,22.97 U$3.P$4
N$2
  Top 0.3: U$2.1 47.96,4.43 R2.1
N$13
  Bottom 0.5: BUZZER.P$1 SI2302.3
N$14
  Bottom 0.3: R10.2 R9.1 16.81,43.83 SI2302.1
N$15
  Bottom 0.3: R19.2 22.3,57.12 C5.2 22.87,55.54 INA.2
N$18
  Bottom 0.3: R18.2 22.3,53.82 C5.1 22.77,54.89 INA.1
N$20
  Bottom 0.5: IRF7905.7 IRF7905.8 30.17,72.05 PERE_L.2
N$21
  Bottom 0.5: IRF7905.5 IRF7905.6 24.74,65.73 PERE_SP.2
N$22
  Bottom 0.3: IRF7905.2 38.68,67 R22.1 R23.2
N$23
  Bottom 0.3: IRF7905.4 38.35,64.46 R24.1 R25.2
N$24
  Bottom 0.3: NDC7002.6 48.38,42 49.73,42 50.4,42.67 50.4,43.47 | R32.2 50.4,48.12 50.4,45.47 | U$5.P$1 50.4,45.47 | 50.4,43.47 50.4,45.47 | U$5.P$3 50.4,43.47
N$25
  Bottom 0.3: NDC7002_.6 47.52,24.54 47.07,24.54 45.7,23.17 45.7,22.97 | R26.2 45.7,19.02 45.7,20.97 | 45.7,22.97 45.7,20.97 | U$3.P$1 45.7,20.97 | U$3.P$3 45.7,22.97
N$26
  Bottom 0.3: R27.2 50.3,19.02 50.3,20.97 | 50.3,22.97 50.3,20.97 | U$4.P$3 50.3,20.97 | 50.3,22.97 50.3,24.32 NDC7002_.4 | U$4.P$1 50.3,22.97
N$27
  Bottom 0.3: R33.2 45.2,48.32 45.2,45.47 | U$6.P$3 45.2,45.47 | NDC7002.4 45.2,42.62 45.2,43.47 | 45.2,43.47 45.2,45.47 | U$6.P$1 45.2,43.47
N$28
  Bottom 0.3: R36.2 49.8,37.92 49.8,39.07 | 49.8,39.07 R34.2 | NDC7002.1 49.8,39.07
N$29
  Bottom 0.3: R37.2 44.4,37.92 44.4,39.17 | 44.4,39.17 R35.2 | NDC7002.3 44.5,39.07 44.4,39.17
N$32
  Bottom 0.3: R30.2 46.1,28.72 46.1,27.47 | 46.1,27.47 R28.2 | NDC7002_.1 46.1,27.47
N$35
  Bottom 0.3: R31.2 51.5,28.62 51.5,27.47 | 51.5,27.47 R29.2 | NDC7002_.3 51.5,27.47
OE_SR  (via drill 0.35)
  Top 0.3: STM32F411.25 52.67,22 50.9,23.77 44.6,23.77 42.5,25.87 34.2,25.87 v33.2,24.87
  Bottom 0.3: R14.2 18.72,32.89 74HC595.13 21.47,32.89 29.5,24.87 v33.2,24.87 | STM32F411.25 57.13,22 64.21,29.08 JP3.11
PERE1
  Bottom 0.3: R23.1 41.85,68.82 42.7,67.97 42.7,62.86 41.9,62.07 39,62.07 36.4,59.47 36.4,38.66 31.28,33.54 74HC595.3
PERE2
  Bottom 0.3: R25.1 41.75,65.72 42,65.47 42,63.27 41.5,62.77 38.7,62.77 35.7,59.77 35.7,38.97 30.92,34.19 74HC595.2
RX_GPS
  Top 0.3: JP4.11 9.8,28.54 10.79,29.53 10.79,33.16 12.2,34.57 23.73,34.57 28.94,39.78 STM32F411.9
RX_LIDAR
  Bottom 0.3: STM32F411.29 57.09,32.16 64.18,39.25 64.18,39.24 JP3.7
RX_RADIO
  Bottom 0.3: STM32F411.31 57.07,37.24 64.15,44.32 JP3.5
SCK_SENS  (via drill 0.35)
  Top 0.3: JP4.12 9.73,26 11.35,27.62 11.35,33 12.34,34 18.5,34 | STM32F411.11 38.2,34.7 37.5,34 18.5,34 | v18.5,31.57 18.5,34
  Bottom 0.3: 74HC595.11 18.52,31.59 v18.5,31.57
SCL  (via drill 0.35)
  Top 0.3: v30.01,55.48 31.89,55.48 BME280.P$2 34.47,54.74 38.6,58.87 44.3,58.87 53.23,49.94 STM32F411.36
  Bottom 0.3: INA.5 28.97,56.84 R4.1 29.25,56.24 v30.01,55.48 | STM32F411.36 60.37,49.94 62.37,51.94 JP3.2
SDA
  Top 0.3: BME280.P$1 34.81,57.28 39,61.47 43.9,61.47 52.9,52.47 STM32F411.37
  Bottom 0.3: INA.6 27.97,56.19 29.25,54.92 R3.1 30.15,53.47 33.1,53.47 33.8,54.17 33.8,56.11 BME280.P$1 | STM32F411.37 60.01,52.48 62.01,54.48 JP3.1
SHIFT
  Bottom 0.3: 74HC595.9 16.77,30.29 15.1,31.97 15.1,35.76 10.89,39.97 6.4,39.97 5.6,40.77 5.6,42.97 6.41,43.78 JP4.5
SP+
  Bottom 0.3: R18.1 19.4,52.47 R20.2
  Bottom 0.5: R20.2 14.5,52.67 11.3,55.87 7,55.87 5.75,54.62 5.75,52.32 4.8,51.37 4.8,42.87 1.8,39.87 1.8,36.17 3.1,34.87 3.1,29.57 5.25,27.42 5.25,25.22 6.5,23.97 8,23.97 9,22.97 9,21.91 8.29,21.2 SP.1
SP-
  Bottom 0.5: R21.2 28.4,62.07 27,63.47 17.5,63.47 10.9,56.87 6.61,56.87 4.85,55.11 4.85,52.92 3.8,51.87 3.8,43.36 0.8,40.36 0.8,35.67 2.1,34.37 2.1,29.07 4.35,26.82 4.35,24.12 6.17,22.3 SP.2
SWITCH
  Top 0.3: STM32F411.21 55.5,7.57 51.77,3.84 STATE.A 50.44,2.72 46.9,1.77 45.6,3.07 U$2.2
TX_GPS
  Top 0.3: JP4.10 9.8,31.08 10.29,31.57 10.29,33.36 12,35.07 23.42,35.07 28.67,40.32 36.8,40.32 38.8,42.32 STM32F411.8
TX_LIDAR
  Bottom 0.3: STM32F411.28 57.15,29.62 64.23,36.7 JP3.8
TX_RADIO
  Bottom 0.3: STM32F411.30 57.03,34.7 64.1,41.77 64.1,41.78 JP3.6

### Text on the board
tNames: SDA | 4V | GND | SCl | MOSI_S | 3V3 | 5V | MISO_S | RX_R | SHIFT | GERMO | TX_R | AUX_R | RX_L | TX_L | M1_R | CS_LIS | M0_R | TX_GPS | CS_LSM | OE_SR | RX_GPS | LATCH | SCK_S | FOTO1 | FOTO0